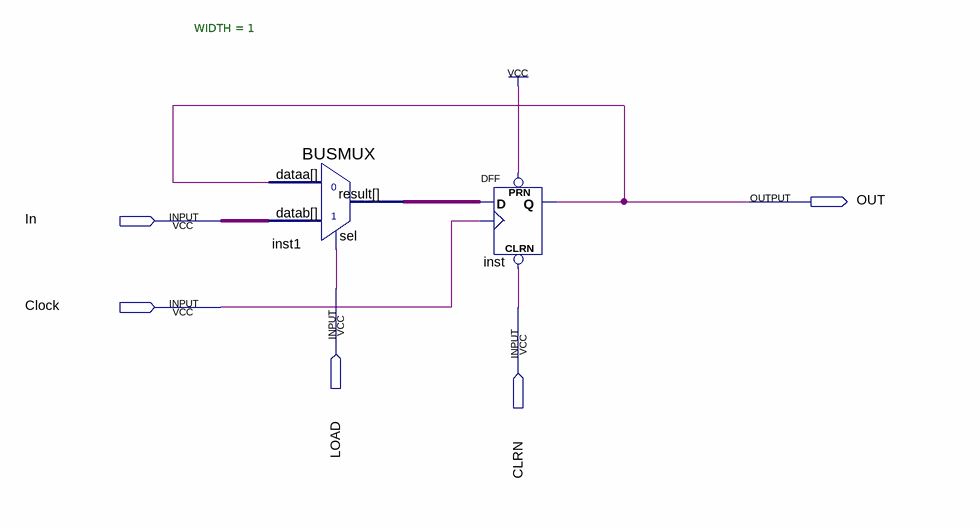
[diagram p0: schematic sheet]
// Quartus schematic register.bdf as structural Verilog: 2 symbols, 5 pins
module register (
  input  In,
  input  LOAD,
  input  Clock,
  input  CLRN,
  output OUT
);

  wire inst1_result;

  BUSMUX #(.WIDTH(1)) inst1 (.datab(In), .sel(LOAD), .dataa(OUT), .result(inst1_result));
  DFF inst (.CLRN(CLRN), .CLK(Clock), .D(inst1_result), .PRN(1'b1), .Q(OUT));
endmodule
